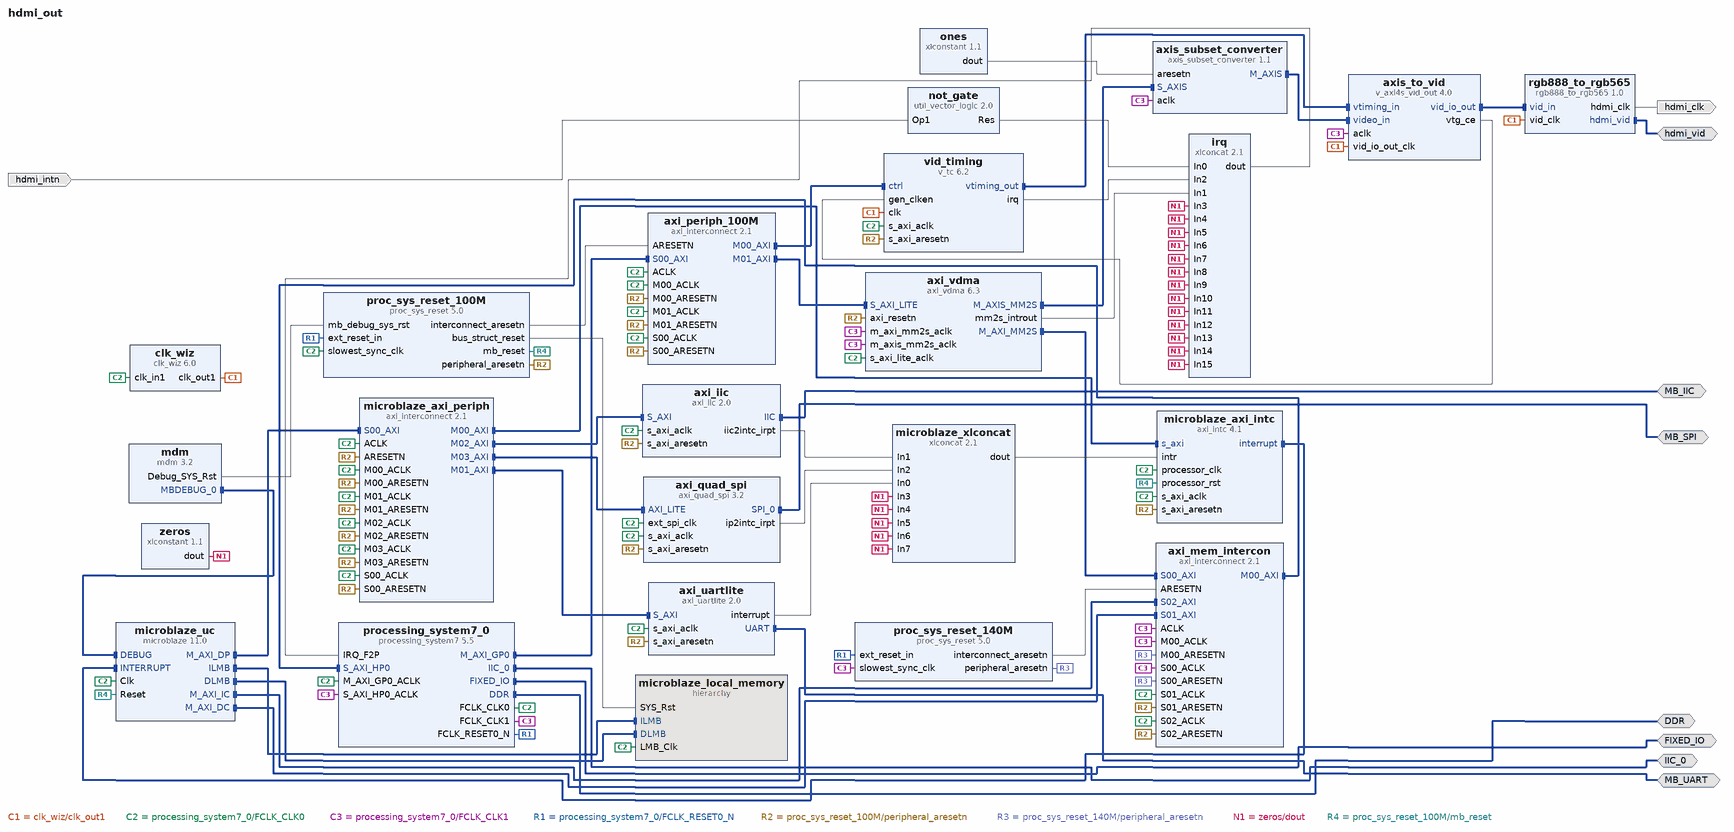
[diagram p0: block diagram of the top level]
# Vivado block design hdmi_out, xc7z020clg400-1, Vivado 2019.2
create_bd_design hdmi_out

create_bd_intf_port -mode Master -vlnv xilinx.com:interface:ddrx_rtl:1.0 DDR
create_bd_intf_port -mode Master -vlnv xilinx.com:display_processing_system7:fixedio_rtl:1.0 FIXED_IO
create_bd_intf_port -mode Master -vlnv xilinx.com:interface:vid_io_rtl:1.0 hdmi_vid
create_bd_intf_port -mode Master -vlnv xilinx.com:interface:iic_rtl:1.0 IIC_0
create_bd_intf_port -mode Master -vlnv xilinx.com:interface:uart_rtl:1.0 MB_UART
create_bd_intf_port -mode Master -vlnv xilinx.com:interface:iic_rtl:1.0 MB_IIC
create_bd_intf_port -mode Master -vlnv xilinx.com:interface:spi_rtl:1.0 MB_SPI
create_bd_port -dir I hdmi_intn
create_bd_port -dir O -type clk hdmi_clk

create_bd_cell -type ip -vlnv xilinx.com:ip:clk_wiz:6.0 clk_wiz
set_property -dict [list \
  CONFIG.CLKOUT1_JITTER 217.614 \
  CONFIG.CLKOUT1_PHASE_ERROR 245.344 \
  CONFIG.CLKOUT1_REQUESTED_OUT_FREQ 148.500 \
  CONFIG.MMCM_CLKFBOUT_MULT_F 37.125 \
  CONFIG.MMCM_CLKOUT0_DIVIDE_F 6.250 \
  CONFIG.MMCM_DIVCLK_DIVIDE 4 \
  CONFIG.USE_LOCKED false \
  CONFIG.USE_RESET false \
] [get_bd_cells clk_wiz]
create_bd_cell -type ip -vlnv xilinx.com:ip:axi_interconnect:2.1 axi_mem_intercon
set_property -dict [list \
  CONFIG.M00_HAS_DATA_FIFO 2 \
  CONFIG.M00_HAS_REGSLICE 4 \
  CONFIG.NUM_MI 1 \
  CONFIG.NUM_SI 3 \
  CONFIG.S00_HAS_DATA_FIFO 2 \
  CONFIG.S00_HAS_REGSLICE 4 \
  CONFIG.S01_HAS_DATA_FIFO 2 \
  CONFIG.S01_HAS_REGSLICE 4 \
  CONFIG.STRATEGY 0 \
] [get_bd_cells axi_mem_intercon]
create_bd_cell -type ip -vlnv xilinx.com:ip:axi_vdma:6.3 axi_vdma
set_property -dict [list \
  CONFIG.c_include_mm2s_dre 0 \
  CONFIG.c_include_s2mm 0 \
  CONFIG.c_m_axi_mm2s_data_width 64 \
  CONFIG.c_m_axis_mm2s_tdata_width 32 \
  CONFIG.c_mm2s_genlock_mode 0 \
  CONFIG.c_mm2s_linebuffer_depth 4096 \
  CONFIG.c_mm2s_max_burst_length 16 \
  CONFIG.c_num_fstores 1 \
] [get_bd_cells axi_vdma]
create_bd_cell -type ip -vlnv xilinx.com:ip:axis_subset_converter:1.1 axis_subset_converter
set_property -dict [list \
  CONFIG.M_TDATA_NUM_BYTES 3 \
  CONFIG.M_TUSER_WIDTH 1 \
  CONFIG.S_TDATA_NUM_BYTES 4 \
  CONFIG.S_TUSER_WIDTH 1 \
  CONFIG.TDATA_REMAP {tdata[31:24],tdata[23:16],tdata[15:8]} \
  CONFIG.TUSER_REMAP {tuser[0:0]} \
] [get_bd_cells axis_subset_converter]
create_bd_cell -type ip -vlnv xilinx.com:ip:proc_sys_reset:5.0 proc_sys_reset_100M
create_bd_cell -type ip -vlnv xilinx.com:ip:proc_sys_reset:5.0 proc_sys_reset_140M
create_bd_cell -type ip -vlnv xilinx.com:ip:processing_system7:5.5 processing_system7_0
set_property -dict [list \
  CONFIG.PCW_CAN0_CAN0_IO {MIO 14 .. 15} \
  CONFIG.PCW_CAN0_PERIPHERAL_ENABLE 1 \
  CONFIG.PCW_ENET0_ENET0_IO {MIO 16 .. 27} \
  CONFIG.PCW_ENET0_GRP_MDIO_ENABLE 1 \
  CONFIG.PCW_ENET0_GRP_MDIO_IO {MIO 52 .. 53} \
  CONFIG.PCW_ENET0_PERIPHERAL_ENABLE 1 \
  CONFIG.PCW_ENET0_RESET_ENABLE 0 \
  CONFIG.PCW_ENET_RESET_ENABLE 1 \
  CONFIG.PCW_ENET_RESET_SELECT {Share reset pin} \
  CONFIG.PCW_EN_CLK1_PORT 1 \
  CONFIG.PCW_FCLK_CLK1_BUF TRUE \
  CONFIG.PCW_FPGA0_PERIPHERAL_FREQMHZ 100 \
  CONFIG.PCW_FPGA1_PERIPHERAL_FREQMHZ 140 \
  CONFIG.PCW_FPGA_FCLK1_ENABLE 1 \
  CONFIG.PCW_GPIO_EMIO_GPIO_ENABLE 1 \
  CONFIG.PCW_GPIO_EMIO_GPIO_IO 64 \
  CONFIG.PCW_GPIO_MIO_GPIO_ENABLE 1 \
  CONFIG.PCW_GPIO_MIO_GPIO_IO MIO \
  CONFIG.PCW_I2C0_I2C0_IO EMIO \
  CONFIG.PCW_I2C0_PERIPHERAL_ENABLE 1 \
  CONFIG.PCW_I2C1_I2C1_IO {MIO 12 .. 13} \
  CONFIG.PCW_I2C1_PERIPHERAL_ENABLE 1 \
  CONFIG.PCW_I2C_PERIPHERAL_FREQMHZ 111.111115 \
  CONFIG.PCW_I2C_RESET_ENABLE 1 \
  CONFIG.PCW_I2C_RESET_SELECT {Share reset pin} \
  CONFIG.PCW_IRQ_F2P_INTR 1 \
  CONFIG.PCW_PRESET_BANK1_VOLTAGE {LVCMOS 1.8V} \
  CONFIG.PCW_QSPI_GRP_FBCLK_ENABLE 1 \
  CONFIG.PCW_QSPI_GRP_FBCLK_IO {MIO 8} \
  CONFIG.PCW_QSPI_GRP_SINGLE_SS_ENABLE 1 \
  CONFIG.PCW_QSPI_GRP_SINGLE_SS_IO {MIO 1 .. 6} \
  CONFIG.PCW_QSPI_PERIPHERAL_ENABLE 1 \
  CONFIG.PCW_QSPI_QSPI_IO {MIO 1 .. 6} \
  CONFIG.PCW_SD0_GRP_CD_ENABLE 1 \
  CONFIG.PCW_SD0_GRP_CD_IO {MIO 46} \
  CONFIG.PCW_SD0_GRP_WP_ENABLE 1 \
  CONFIG.PCW_SD0_GRP_WP_IO {MIO 47} \
  CONFIG.PCW_SD0_PERIPHERAL_ENABLE 1 \
  CONFIG.PCW_SD0_SD0_IO {MIO 40 .. 45} \
  CONFIG.PCW_SDIO_PERIPHERAL_FREQMHZ 50 \
  CONFIG.PCW_SINGLE_QSPI_DATA_MODE x4 \
  CONFIG.PCW_TTC0_PERIPHERAL_ENABLE 1 \
  CONFIG.PCW_TTC0_TTC0_IO EMIO \
  CONFIG.PCW_UART1_PERIPHERAL_ENABLE 1 \
  CONFIG.PCW_UART1_UART1_IO {MIO 48 .. 49} \
  CONFIG.PCW_UART_PERIPHERAL_FREQMHZ 100 \
  CONFIG.PCW_UIPARAM_DDR_PARTNO {MT41J256M16 RE-125} \
  CONFIG.PCW_USB0_PERIPHERAL_ENABLE 1 \
  CONFIG.PCW_USB0_RESET_ENABLE 1 \
  CONFIG.PCW_USB0_RESET_IO {MIO 7} \
  CONFIG.PCW_USB0_USB0_IO {MIO 28 .. 39} \
  CONFIG.PCW_USB_RESET_ENABLE 1 \
  CONFIG.PCW_USB_RESET_SELECT {Share reset pin} \
  CONFIG.PCW_USE_FABRIC_INTERRUPT 1 \
  CONFIG.PCW_USE_S_AXI_HP0 1 \
] [get_bd_cells processing_system7_0]
# 256 more settings of processing_system7_0 are not shown: defaults, MIO pin electricals, DDR timing, and values the tool derives
create_bd_cell -type ip -vlnv xilinx.com:ip:axi_interconnect:2.1 axi_periph_100M
set_property -dict {CONFIG.NUM_MI 2} [get_bd_cells axi_periph_100M]
create_bd_cell -type ip -vlnv xilinx.com:ip:v_axi4s_vid_out:4.0 axis_to_vid
set_property -dict [list \
  CONFIG.C_ADDR_WIDTH 12 \
  CONFIG.C_HAS_ASYNC_CLK 1 \
  CONFIG.C_S_AXIS_VIDEO_DATA_WIDTH 8 \
  CONFIG.C_S_AXIS_VIDEO_FORMAT 2 \
  CONFIG.C_VTG_MASTER_SLAVE 1 \
] [get_bd_cells axis_to_vid]
create_bd_cell -type ip -vlnv xilinx.com:ip:v_tc:6.2 vid_timing
set_property -dict {CONFIG.VIDEO_MODE 1080p CONFIG.enable_detection false} [get_bd_cells vid_timing]
create_bd_cell -type ip -vlnv xilinx.com:ip:xlconcat:2.1 irq
set_property -dict {CONFIG.NUM_PORTS 16} [get_bd_cells irq]
create_bd_cell -type ip -vlnv xilinx.com:ip:xlconstant:1.1 ones
create_bd_cell -type ip -vlnv xilinx.com:ip:util_vector_logic:2.0 not_gate
set_property -dict {CONFIG.C_OPERATION not CONFIG.C_SIZE 1} [get_bd_cells not_gate]
create_bd_cell -type ip -vlnv xilinx.com:ip:xlconstant:1.1 zeros
create_bd_cell -type ip -vlnv user.org:user:rgb888_to_rgb565:1.0 rgb888_to_rgb565
create_bd_cell -type ip -vlnv xilinx.com:ip:microblaze:11.0 microblaze_uc
set_property -dict [list \
  CONFIG.C_DEBUG_ENABLED 1 \
  CONFIG.C_D_AXI 1 \
  CONFIG.C_D_LMB 1 \
  CONFIG.C_I_LMB 1 \
  CONFIG.C_USE_FPU 1 \
  CONFIG.G_TEMPLATE_LIST 9 \
] [get_bd_cells microblaze_uc]
create_bd_cell -type ip -vlnv xilinx.com:ip:axi_interconnect:2.1 microblaze_axi_periph
set_property -dict {CONFIG.NUM_MI 4} [get_bd_cells microblaze_axi_periph]
create_bd_cell -type ip -vlnv xilinx.com:ip:axi_intc:4.1 microblaze_axi_intc
set_property -dict {CONFIG.C_HAS_FAST 1} [get_bd_cells microblaze_axi_intc]
create_bd_cell -type ip -vlnv xilinx.com:ip:xlconcat:2.1 microblaze_xlconcat
set_property -dict {CONFIG.NUM_PORTS 8} [get_bd_cells microblaze_xlconcat]
create_bd_cell -type ip -vlnv xilinx.com:ip:mdm:3.2 mdm
set_property -dict {CONFIG.C_ADDR_SIZE 32 CONFIG.C_MB_DBG_PORTS 1 CONFIG.C_M_AXI_ADDR_WIDTH 32} [get_bd_cells mdm]
create_bd_cell -type ip -vlnv xilinx.com:ip:axi_uartlite:2.0 axi_uartlite
create_bd_cell -type ip -vlnv xilinx.com:ip:axi_iic:2.0 axi_iic
create_bd_cell -type ip -vlnv xilinx.com:ip:axi_quad_spi:3.2 axi_quad_spi
set_property -dict {CONFIG.C_NUM_SS_BITS 2 CONFIG.C_SCK_RATIO 2 CONFIG.C_USE_STARTUP 0} [get_bd_cells axi_quad_spi]
create_bd_cell -type hier microblaze_local_memory

# ---- hierarchy /microblaze_local_memory ----
current_bd_instance /microblaze_local_memory
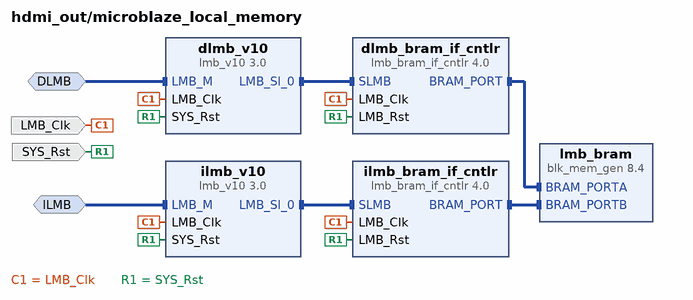
[diagram p1: block diagram inside /microblaze_local_memory]
create_bd_intf_pin -mode MirroredMaster -vlnv xilinx.com:interface:lmb_rtl:1.0 DLMB
create_bd_intf_pin -mode MirroredMaster -vlnv xilinx.com:interface:lmb_rtl:1.0 ILMB
create_bd_pin -dir I -type clk LMB_Clk
create_bd_pin -dir I -type rst SYS_Rst

create_bd_cell -type ip -vlnv xilinx.com:ip:lmb_v10:3.0 dlmb_v10
create_bd_cell -type ip -vlnv xilinx.com:ip:lmb_v10:3.0 ilmb_v10
create_bd_cell -type ip -vlnv xilinx.com:ip:lmb_bram_if_cntlr:4.0 dlmb_bram_if_cntlr
set_property -dict {CONFIG.C_ECC 0} [get_bd_cells dlmb_bram_if_cntlr]
create_bd_cell -type ip -vlnv xilinx.com:ip:lmb_bram_if_cntlr:4.0 ilmb_bram_if_cntlr
set_property -dict {CONFIG.C_ECC 0} [get_bd_cells ilmb_bram_if_cntlr]
create_bd_cell -type ip -vlnv xilinx.com:ip:blk_mem_gen:8.4 lmb_bram
set_property -dict {CONFIG.Memory_Type True_Dual_Port_RAM CONFIG.use_bram_block BRAM_Controller} [get_bd_cells lmb_bram]

# ---- connections ----

current_bd_instance /microblaze_local_memory
connect_bd_intf_net -intf_net microblaze_0_dlmb_bus [get_bd_intf_pins dlmb_v10/LMB_Sl_0] [get_bd_intf_pins dlmb_bram_if_cntlr/SLMB]
connect_bd_intf_net -intf_net microblaze_0_dlmb [get_bd_intf_pins DLMB] [get_bd_intf_pins dlmb_v10/LMB_M]
connect_bd_intf_net -intf_net microblaze_0_ilmb [get_bd_intf_pins ILMB] [get_bd_intf_pins ilmb_v10/LMB_M]
connect_bd_intf_net -intf_net microblaze_0_ilmb_bus [get_bd_intf_pins ilmb_v10/LMB_Sl_0] [get_bd_intf_pins ilmb_bram_if_cntlr/SLMB]
connect_bd_intf_net -intf_net microblaze_0_ilmb_cntlr [get_bd_intf_pins ilmb_bram_if_cntlr/BRAM_PORT] [get_bd_intf_pins lmb_bram/BRAM_PORTB]
connect_bd_intf_net -intf_net microblaze_0_dlmb_cntlr [get_bd_intf_pins dlmb_bram_if_cntlr/BRAM_PORT] [get_bd_intf_pins lmb_bram/BRAM_PORTA]
connect_bd_net -net microblaze_0_Clk [get_bd_pins LMB_Clk] \
  [get_bd_pins dlmb_v10/LMB_Clk] [get_bd_pins dlmb_bram_if_cntlr/LMB_Clk] [get_bd_pins ilmb_v10/LMB_Clk] \
  [get_bd_pins ilmb_bram_if_cntlr/LMB_Clk]
connect_bd_net [get_bd_pins SYS_Rst] \
  [get_bd_pins dlmb_v10/SYS_Rst] [get_bd_pins dlmb_bram_if_cntlr/LMB_Rst] [get_bd_pins ilmb_v10/SYS_Rst] \
  [get_bd_pins ilmb_bram_if_cntlr/LMB_Rst]
set_property HDL_ATTRIBUTE.BMM_INFO_ADDRESS_SPACE {byte  0x40000000 32 > hdmi_out microblaze_local_memory/lmb_bram} [get_bd_cells dlmb_bram_if_cntlr]
set_property HDL_ATTRIBUTE.KEEP_HIERARCHY yes [get_bd_cells dlmb_bram_if_cntlr]

current_bd_instance /
connect_bd_intf_net -intf_net v_tc_0_vtiming_out [get_bd_intf_pins axis_to_vid/vtiming_in] [get_bd_intf_pins vid_timing/vtiming_out]
connect_bd_intf_net -intf_net axi_vdma_0_M_AXI_MM2S [get_bd_intf_pins axi_mem_intercon/S00_AXI] [get_bd_intf_pins axi_vdma/M_AXI_MM2S]
connect_bd_intf_net [get_bd_intf_ports IIC_0] [get_bd_intf_pins processing_system7_0/IIC_0]
connect_bd_intf_net [get_bd_intf_pins axi_mem_intercon/M00_AXI] [get_bd_intf_pins processing_system7_0/S_AXI_HP0]
connect_bd_intf_net -intf_net axis_subset_converter_0_M_AXIS [get_bd_intf_pins axis_subset_converter/M_AXIS] [get_bd_intf_pins axis_to_vid/video_in]
connect_bd_intf_net [get_bd_intf_pins axi_periph_100M/M01_AXI] [get_bd_intf_pins axi_vdma/S_AXI_LITE]
connect_bd_intf_net -intf_net axi_vdma_0_M_AXIS_MM2S [get_bd_intf_pins axi_vdma/M_AXIS_MM2S] [get_bd_intf_pins axis_subset_converter/S_AXIS]
connect_bd_intf_net [get_bd_intf_ports hdmi_vid] [get_bd_intf_pins rgb888_to_rgb565/hdmi_vid]
connect_bd_intf_net [get_bd_intf_pins processing_system7_0/M_AXI_GP0] [get_bd_intf_pins axi_periph_100M/S00_AXI]
connect_bd_intf_net [get_bd_intf_pins axi_periph_100M/M00_AXI] [get_bd_intf_pins vid_timing/ctrl]
connect_bd_intf_net [get_bd_intf_ports FIXED_IO] [get_bd_intf_pins processing_system7_0/FIXED_IO]
connect_bd_intf_net [get_bd_intf_pins axis_to_vid/vid_io_out] [get_bd_intf_pins rgb888_to_rgb565/vid_in]
connect_bd_intf_net [get_bd_intf_ports DDR] [get_bd_intf_pins processing_system7_0/DDR]
connect_bd_intf_net [get_bd_intf_pins microblaze_uc/ILMB] [get_bd_intf_pins microblaze_local_memory/ILMB]
connect_bd_intf_net -intf_net microblaze_M_AXI_IC [get_bd_intf_pins microblaze_uc/M_AXI_IC] [get_bd_intf_pins axi_mem_intercon/S02_AXI]
connect_bd_intf_net [get_bd_intf_pins microblaze_uc/DLMB] [get_bd_intf_pins microblaze_local_memory/DLMB]
connect_bd_intf_net [get_bd_intf_pins axi_iic/S_AXI] [get_bd_intf_pins microblaze_axi_periph/M02_AXI]
connect_bd_intf_net [get_bd_intf_pins microblaze_axi_periph/M01_AXI] [get_bd_intf_pins axi_uartlite/S_AXI]
connect_bd_intf_net -intf_net microblaze_M_AXI_DC [get_bd_intf_pins microblaze_uc/M_AXI_DC] [get_bd_intf_pins axi_mem_intercon/S01_AXI]
connect_bd_intf_net -intf_net microblaze_0_debug [get_bd_intf_pins mdm/MBDEBUG_0] [get_bd_intf_pins microblaze_uc/DEBUG]
connect_bd_intf_net [get_bd_intf_ports MB_SPI] [get_bd_intf_pins axi_quad_spi/SPI_0]
connect_bd_intf_net -intf_net microblaze_0_axi_dp [get_bd_intf_pins microblaze_axi_periph/S00_AXI] [get_bd_intf_pins microblaze_uc/M_AXI_DP]
connect_bd_intf_net -intf_net microblaze_0_intc_axi [get_bd_intf_pins microblaze_axi_periph/M00_AXI] [get_bd_intf_pins microblaze_axi_intc/s_axi]
connect_bd_intf_net -intf_net microblaze_0_interrupt [get_bd_intf_pins microblaze_axi_intc/interrupt] [get_bd_intf_pins microblaze_uc/INTERRUPT]
connect_bd_intf_net [get_bd_intf_ports MB_IIC] [get_bd_intf_pins axi_iic/IIC]
connect_bd_intf_net [get_bd_intf_ports MB_UART] [get_bd_intf_pins axi_uartlite/UART]
connect_bd_intf_net [get_bd_intf_pins microblaze_axi_periph/M03_AXI] [get_bd_intf_pins axi_quad_spi/AXI_LITE]
connect_bd_net -net clk_wiz_0_clk_out1 [get_bd_pins clk_wiz/clk_out1] \
  [get_bd_pins axis_to_vid/vid_io_out_clk] [get_bd_pins vid_timing/clk] [get_bd_pins rgb888_to_rgb565/vid_clk]
connect_bd_net -net util_vector_logic_0_Res [get_bd_pins not_gate/Res] [get_bd_pins irq/In0]
connect_bd_net [get_bd_ports hdmi_intn] [get_bd_pins not_gate/Op1]
connect_bd_net -net axi_vdma_0_mm2s_introut [get_bd_pins axi_vdma/mm2s_introut] [get_bd_pins irq/In1]
connect_bd_net -net microblaze_0_Clk [get_bd_pins processing_system7_0/FCLK_CLK0] \
  [get_bd_pins clk_wiz/clk_in1] [get_bd_pins axi_vdma/s_axi_lite_aclk] [get_bd_pins proc_sys_reset_100M/slowest_sync_clk] \
  [get_bd_pins processing_system7_0/M_AXI_GP0_ACLK] [get_bd_pins vid_timing/s_axi_aclk] [get_bd_pins axi_periph_100M/ACLK] \
  [get_bd_pins axi_periph_100M/M00_ACLK] [get_bd_pins axi_periph_100M/M01_ACLK] [get_bd_pins axi_periph_100M/S00_ACLK] \
  [get_bd_pins microblaze_uc/Clk] [get_bd_pins microblaze_axi_periph/ACLK] [get_bd_pins microblaze_axi_periph/S00_ACLK] \
  [get_bd_pins microblaze_axi_periph/M00_ACLK] [get_bd_pins microblaze_axi_intc/s_axi_aclk] \
  [get_bd_pins microblaze_axi_intc/processor_clk] [get_bd_pins axi_mem_intercon/S01_ACLK] \
  [get_bd_pins axi_mem_intercon/S02_ACLK] [get_bd_pins axi_uartlite/s_axi_aclk] [get_bd_pins microblaze_axi_periph/M01_ACLK] \
  [get_bd_pins microblaze_axi_periph/M02_ACLK] [get_bd_pins microblaze_axi_periph/M03_ACLK] [get_bd_pins axi_iic/s_axi_aclk] \
  [get_bd_pins axi_quad_spi/s_axi_aclk] [get_bd_pins axi_quad_spi/ext_spi_clk] [get_bd_pins microblaze_local_memory/LMB_Clk]
connect_bd_net [get_bd_pins processing_system7_0/FCLK_CLK1] \
  [get_bd_pins axi_vdma/m_axi_mm2s_aclk] [get_bd_pins axi_vdma/m_axis_mm2s_aclk] [get_bd_pins axis_subset_converter/aclk] \
  [get_bd_pins proc_sys_reset_140M/slowest_sync_clk] [get_bd_pins processing_system7_0/S_AXI_HP0_ACLK] \
  [get_bd_pins axis_to_vid/aclk] [get_bd_pins axi_mem_intercon/ACLK] [get_bd_pins axi_mem_intercon/M00_ACLK] \
  [get_bd_pins axi_mem_intercon/S00_ACLK]
connect_bd_net [get_bd_pins processing_system7_0/FCLK_RESET0_N] \
  [get_bd_pins proc_sys_reset_100M/ext_reset_in] [get_bd_pins proc_sys_reset_140M/ext_reset_in]
connect_bd_net -net rst_processing_system7_0_100M_interconnect_aresetn [get_bd_pins proc_sys_reset_100M/interconnect_aresetn] \
  [get_bd_pins axi_periph_100M/ARESETN]
connect_bd_net -net rst_processing_system7_0_100M_peripheral_aresetn [get_bd_pins proc_sys_reset_100M/peripheral_aresetn] \
  [get_bd_pins axi_vdma/axi_resetn] [get_bd_pins vid_timing/s_axi_aresetn] [get_bd_pins axi_periph_100M/M00_ARESETN] \
  [get_bd_pins axi_periph_100M/M01_ARESETN] [get_bd_pins axi_periph_100M/S00_ARESETN] \
  [get_bd_pins microblaze_axi_periph/ARESETN] [get_bd_pins microblaze_axi_periph/S00_ARESETN] \
  [get_bd_pins microblaze_axi_periph/M00_ARESETN] [get_bd_pins microblaze_axi_intc/s_axi_aresetn] \
  [get_bd_pins axi_mem_intercon/S01_ARESETN] [get_bd_pins axi_mem_intercon/S02_ARESETN] \
  [get_bd_pins axi_uartlite/s_axi_aresetn] [get_bd_pins microblaze_axi_periph/M01_ARESETN] \
  [get_bd_pins microblaze_axi_periph/M02_ARESETN] [get_bd_pins microblaze_axi_periph/M03_ARESETN] \
  [get_bd_pins axi_iic/s_axi_aresetn] [get_bd_pins axi_quad_spi/s_axi_aresetn]
connect_bd_net -net rst_processing_system7_0_150M_interconnect_aresetn [get_bd_pins proc_sys_reset_140M/interconnect_aresetn] \
  [get_bd_pins axi_mem_intercon/ARESETN]
connect_bd_net -net rst_processing_system7_0_150M_peripheral_aresetn [get_bd_pins proc_sys_reset_140M/peripheral_aresetn] \
  [get_bd_pins axi_mem_intercon/M00_ARESETN] [get_bd_pins axi_mem_intercon/S00_ARESETN]
connect_bd_net -net v_axi4s_vid_out_0_vtg_ce [get_bd_pins axis_to_vid/vtg_ce] [get_bd_pins vid_timing/gen_clken]
connect_bd_net -net v_tc_0_irq [get_bd_pins vid_timing/irq] [get_bd_pins irq/In2]
connect_bd_net -net xlconcat_0_dout [get_bd_pins irq/dout] [get_bd_pins processing_system7_0/IRQ_F2P]
connect_bd_net -net xlconstant_1_dout [get_bd_pins ones/dout] [get_bd_pins axis_subset_converter/aresetn]
connect_bd_net -net tie_to_gnd_dout [get_bd_pins zeros/dout] \
  [get_bd_pins irq/In3] [get_bd_pins irq/In4] [get_bd_pins irq/In5] [get_bd_pins irq/In6] [get_bd_pins irq/In7] \
  [get_bd_pins irq/In8] [get_bd_pins irq/In9] [get_bd_pins irq/In10] [get_bd_pins irq/In11] [get_bd_pins irq/In12] \
  [get_bd_pins irq/In13] [get_bd_pins irq/In14] [get_bd_pins irq/In15] [get_bd_pins microblaze_xlconcat/In3] \
  [get_bd_pins microblaze_xlconcat/In4] [get_bd_pins microblaze_xlconcat/In5] [get_bd_pins microblaze_xlconcat/In6] \
  [get_bd_pins microblaze_xlconcat/In7]
connect_bd_net -net rgb888_to_rgb565_0_hdmi_clk [get_bd_pins rgb888_to_rgb565/hdmi_clk] [get_bd_ports hdmi_clk]
connect_bd_net -net microblaze_0_intr [get_bd_pins microblaze_xlconcat/dout] [get_bd_pins microblaze_axi_intc/intr]
connect_bd_net [get_bd_pins proc_sys_reset_100M/mb_reset] [get_bd_pins microblaze_uc/Reset] [get_bd_pins microblaze_axi_intc/processor_rst]
connect_bd_net -net mdm_1_debug_sys_rst [get_bd_pins mdm/Debug_SYS_Rst] [get_bd_pins proc_sys_reset_100M/mb_debug_sys_rst]
connect_bd_net [get_bd_pins axi_uartlite/interrupt] [get_bd_pins microblaze_xlconcat/In0]
connect_bd_net [get_bd_pins axi_iic/iic2intc_irpt] [get_bd_pins microblaze_xlconcat/In1]
connect_bd_net [get_bd_pins axi_quad_spi/ip2intc_irpt] [get_bd_pins microblaze_xlconcat/In2]
connect_bd_net [get_bd_pins proc_sys_reset_100M/bus_struct_reset] [get_bd_pins microblaze_local_memory/SYS_Rst]
set_property HDL_ATTRIBUTE.BMM_INFO_PROCESSOR {microblaze-le > hdmi_out microblaze_local_memory/dlmb_bram_if_cntlr} [get_bd_cells microblaze_uc]
set_property HDL_ATTRIBUTE.KEEP_HIERARCHY yes [get_bd_cells microblaze_uc]

# ---- address map ----
assign_bd_address -offset 0x00000000 -range 512M -target_address_space [get_bd_addr_spaces axi_vdma/Data_MM2S] [get_bd_addr_segs processing_system7_0/S_AXI_HP0/HP0_DDR_LOWOCM]
assign_bd_address -offset 0x00000000 -range 512M -target_address_space [get_bd_addr_spaces microblaze_uc/Data] [get_bd_addr_segs processing_system7_0/S_AXI_HP0/HP0_DDR_LOWOCM]
assign_bd_address -offset 0x40000000 -range 8K -target_address_space [get_bd_addr_spaces microblaze_uc/Data] [get_bd_addr_segs microblaze_local_memory/dlmb_bram_if_cntlr/SLMB/Mem]
assign_bd_address -offset 0x41000000 -range 64K -target_address_space [get_bd_addr_spaces microblaze_uc/Data] [get_bd_addr_segs microblaze_axi_intc/S_AXI/Reg]
assign_bd_address -offset 0x42000000 -range 64K -target_address_space [get_bd_addr_spaces microblaze_uc/Data] [get_bd_addr_segs axi_uartlite/S_AXI/Reg]
assign_bd_address -offset 0x43000000 -range 64K -target_address_space [get_bd_addr_spaces microblaze_uc/Data] [get_bd_addr_segs axi_iic/S_AXI/Reg]
assign_bd_address -offset 0x44000000 -range 64K -target_address_space [get_bd_addr_spaces microblaze_uc/Data] [get_bd_addr_segs axi_quad_spi/AXI_LITE/Reg]
assign_bd_address -offset 0x00000000 -range 512M -target_address_space [get_bd_addr_spaces microblaze_uc/Instruction] [get_bd_addr_segs processing_system7_0/S_AXI_HP0/HP0_DDR_LOWOCM]
assign_bd_address -offset 0x40000000 -range 8K -target_address_space [get_bd_addr_spaces microblaze_uc/Instruction] [get_bd_addr_segs microblaze_local_memory/ilmb_bram_if_cntlr/SLMB/Mem]
assign_bd_address -offset 0x40000000 -range 64K -target_address_space [get_bd_addr_spaces processing_system7_0/Data] [get_bd_addr_segs axi_vdma/S_AXI_LITE/Reg]
assign_bd_address -offset 0x40100000 -range 64K -target_address_space [get_bd_addr_spaces processing_system7_0/Data] [get_bd_addr_segs vid_timing/ctrl/Reg]

validate_bd_design
save_bd_design
